# EAGLE design soil_sensor (EAGLE 9.6.2)
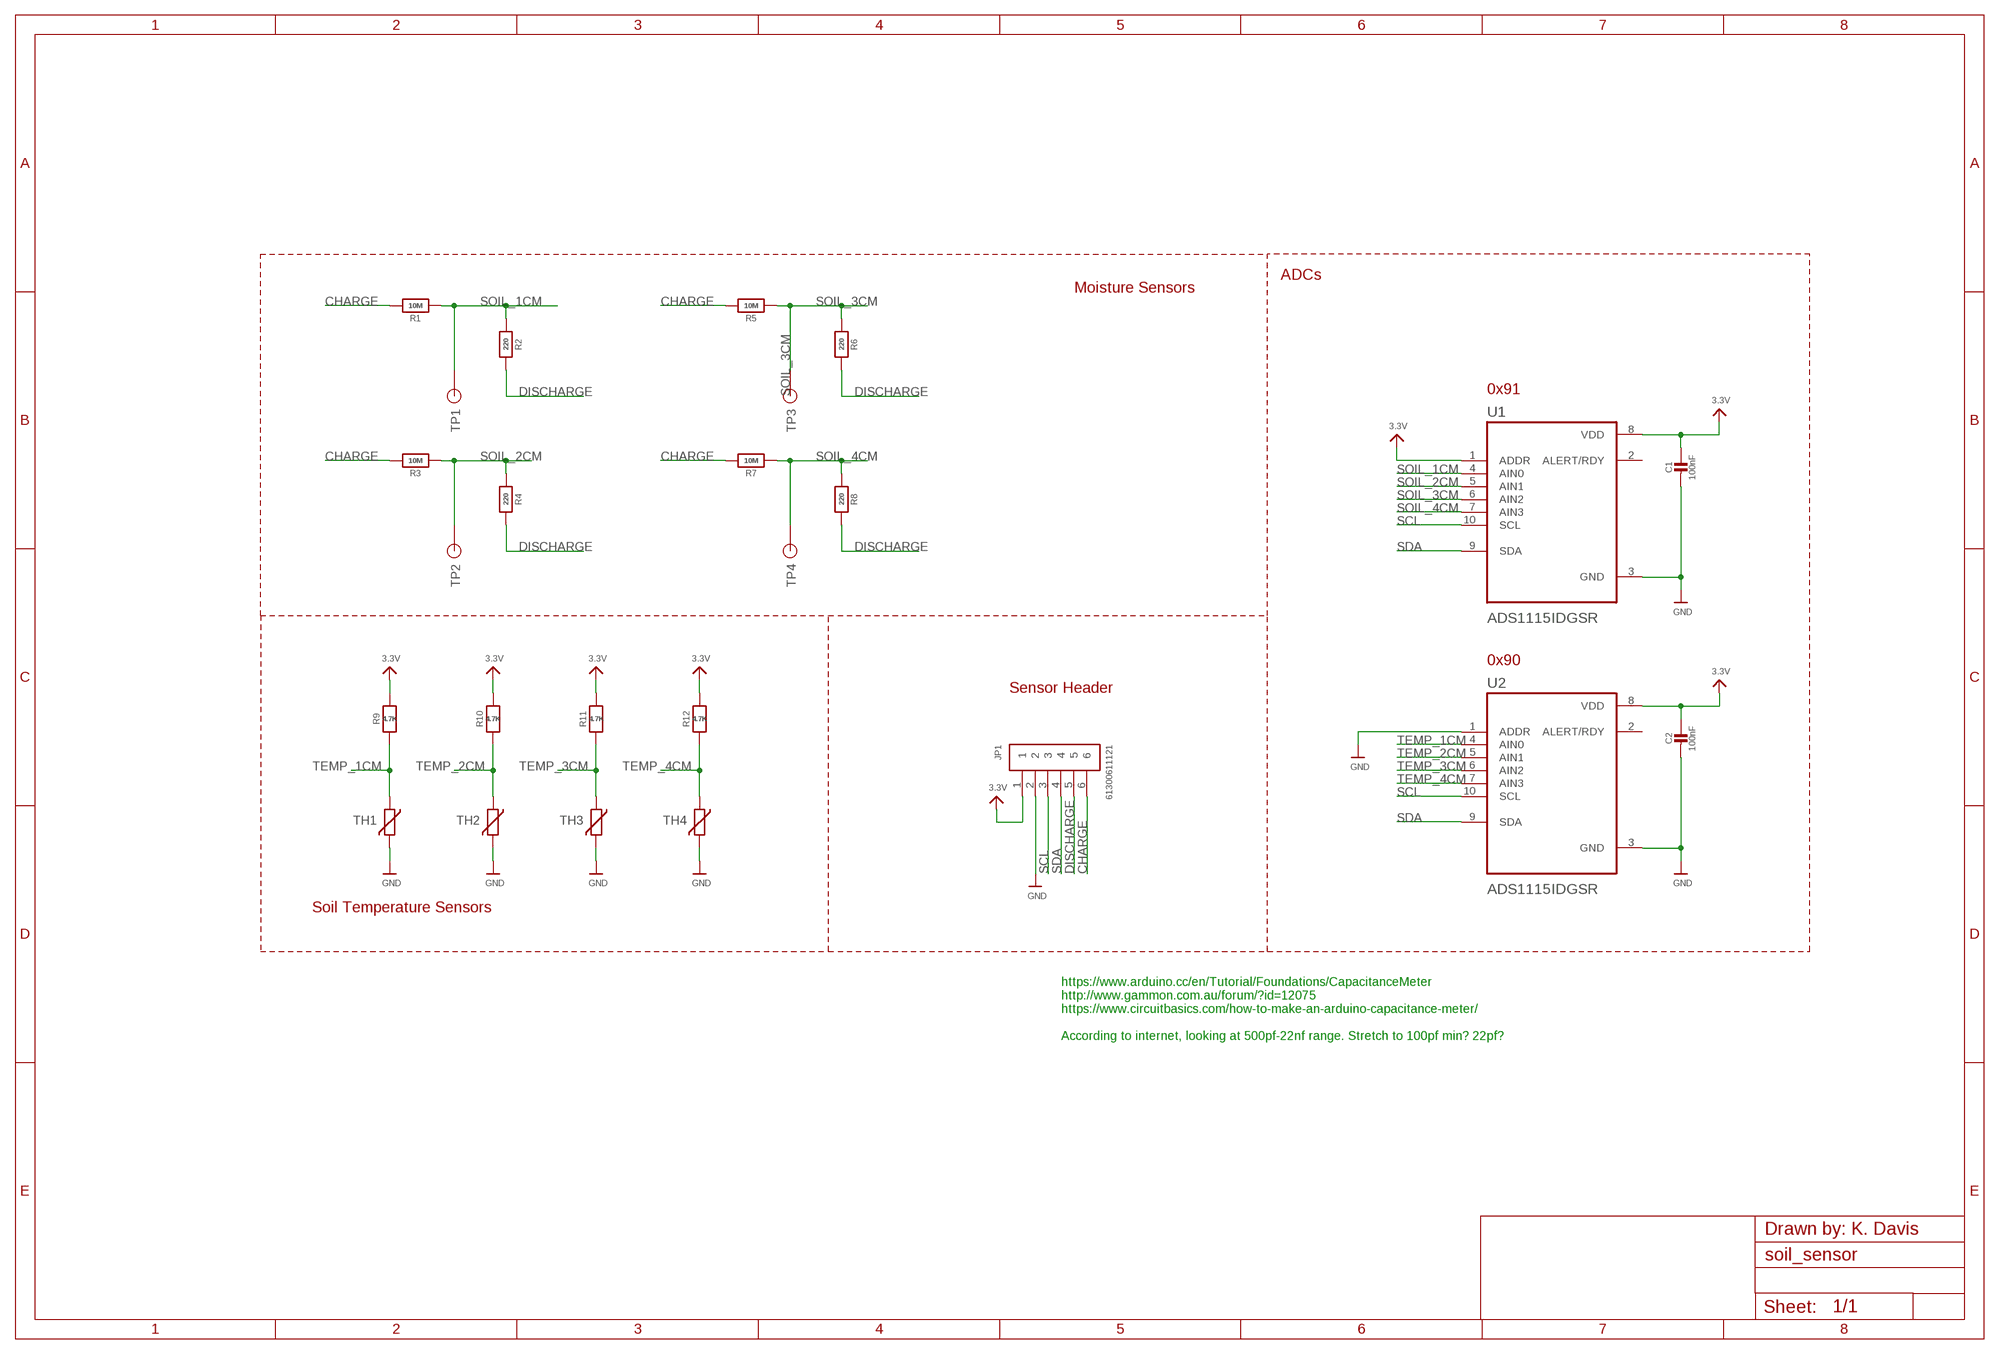
[diagram p0: schematic, sheet 1]

## Parts
C1  100nF  CAP_CERAMIC0805-NOOUTLINE  [0805-NO]
C2  100nF  CAP_CERAMIC0805-NOOUTLINE  [0805-NO]
JP1  61300611121  [61300611121]
R1  10M  RESISTOR0805_NOOUTLINE  [0805-NO]
R2  220  RESISTOR0805_NOOUTLINE  [0805-NO]
R3  10M  RESISTOR0805_NOOUTLINE  [0805-NO]
R4  220  RESISTOR0805_NOOUTLINE  [0805-NO]
R5  10M  RESISTOR0805_NOOUTLINE  [0805-NO]
R6  220  RESISTOR0805_NOOUTLINE  [0805-NO]
R7  10M  RESISTOR0805_NOOUTLINE  [0805-NO]
R8  220  RESISTOR0805_NOOUTLINE  [0805-NO]
R9  4.7K  RESISTOR0805_NOOUTLINE  [0805-NO]
R10  4.7K  RESISTOR0805_NOOUTLINE  [0805-NO]
R11  4.7K  RESISTOR0805_NOOUTLINE  [0805-NO]
R12  4.7K  RESISTOR0805_NOOUTLINE  [0805-NO]
TH1  VARISTORCN0805  [CT/CN0805]
TH2  VARISTORCN0805  [CT/CN0805]
TH3  VARISTORCN0805  [CT/CN0805]
TH4  VARISTORCN0805  [CT/CN0805]
TP1  TP  [TP_50MIL_CIRC]
TP2  TP  [TP_50MIL_CIRC]
TP3  TP  [TP_50MIL_CIRC]
TP4  TP  [TP_50MIL_CIRC]
U1  ADS1115IDGSR  [SOP50P490X110-10N]
U2  ADS1115IDGSR  [SOP50P490X110-10N]

## Nets
3.3V: C1.1 C2.1 JP1.1 R9.2 R10.2 R11.2 R12.2 U1.1(ADDR) U1.8(VDD) U2.8(VDD)
CHARGE: JP1.6 R1.2 R3.2 R5.2 R7.2
DISCHARGE: JP1.5 R2.2 R4.2 R6.2 R8.2
GND: C1.2 C2.2 JP1.2 TH1.2 TH2.2 TH3.2 TH4.2 U1.3(GND) U2.1(ADDR) U2.3(GND)
SCL: JP1.3 U1.10(SCL) U2.10(SCL)
SDA: JP1.4 U1.9(SDA) U2.9(SDA)
SOIL_1CM: R1.1 R2.1 TP1.1(TP) U1.4(AIN0)
SOIL_2CM: R3.1 R4.1 TP2.1(TP) U1.5(AIN1)
SOIL_3CM: R5.1 R6.1 TP3.1(TP) U1.6(AIN2)
SOIL_4CM: R7.1 R8.1 TP4.1(TP) U1.7(AIN3)
TEMP_1CM: R9.1 TH1.1 U2.4(AIN0)
TEMP_2CM: R10.1 TH2.1 U2.5(AIN1)
TEMP_3CM: R11.1 TH3.1 U2.6(AIN2)
TEMP_4CM: R12.1 TH4.1 U2.7(AIN3)
Unconnected: U1.2(ALERT/RDY) U2.2(ALERT/RDY)

## Notes on the sheet
- ADCs
- Moisture Sensors
- 0x91
- 0x90
- Sensor Header
- Soil Temperature Sensors
- https://www.arduino.cc/en/Tutorial/Foundations/CapacitanceMeter
  http://www.gammon.com.au/forum/?id=12075
  https://www.circuitbasics.com/how-to-make-an-arduino-capacitance-meter/
  
  According to internet, looking at 500pf-22nf range. Stretch to 100pf min? 22pf?
- Drawn by: K. Davis

## Library data of the parts
C1 C2 = microbuilder:CAP_CERAMIC: Ceramic Capacitors For new designs, use the packages preceded by an '_' character since they are more reliable: The following footprints should be used on most boards: _0402 - Standard footprint for regular board layouts _0603 - Standard footprint for regular board layouts _0805 - Standard footprint for regular board layouts _1206 - Standard footprint for regular board layouts For extremely tight-pitch boards where space is at a premium, the following 'micro-pitch' footprints can be used (smaller pads, no silkscreen outline, etc.): _0402MP - Micro-pitch footprint for very dense/compact boards _0603MP - Micro-pitch footprint for very dense/compact boards _0805MP - Micro-pitch footprint for very dense/compact boards _1206MP - Micro-pitch footprint for very dense/compact boards
JP1 = EarthPodLib:61300611121: CONN HEADER VERT 5POS 2.54MM Manufacturer's datasheet <https://katalog.we-online.de/em/datasheet/6130xx11121.pdf>; CREATED_BY: PCBLayout.com; DIGI_KEY_PART_NUMBER: 732-5318-ND; MANUFACTURER: Wurth Electronics Inc.; MPN: 61300511121
R1-R12 = microbuilder:RESISTOR: Resistors For new designs, use the packages preceded by an '_' character since they are more reliable: The following footprints should be used on most boards: _0402 - Standard footprint for regular board layouts _0603 - Standard footprint for regular board layouts _0805 - Standard footprint for regular board layouts _1206 - Standard footprint for regular board layouts For extremely tight-pitch boards where space is at a premium, the following 'micro-pitch' footprints can be used (smaller pads, no silkscreen outline, etc.): _0402MP - Micro-pitch footprint for very dense/compact boards _0603MP - Micro-pitch footprint for very dense/compact boards _0805MP - Micro-pitch footprint for very dense/compact boards _1206MP - Micro-pitch footprint for very dense/compact boards
TH1-TH4 = varistor:VARISTOR: VARISTOR
TP1-TP4 = EarthPodLib:TP
U1 U2 = EarthPodLib:ADS1115IDGSR: Check availability <https://pricing.snapeda.com/parts/ADS1115IDGSR/Texas%20Instruments/view-part?ref=eda>; AVAILABILITY: In Stock; DESCRIPTION: 16-Bit 860SPS 4-Ch Delta-Sigma ADC With PGA, Oscillator, Vref, Comparator, and I2C 10-VSSOP -40 to 125; MF: Texas Instruments; MP: ADS1115IDGSR; PACKAGE: VSSOP-10 Texas Instruments; PRICE: None; PURCHASE-URL: https://pricing.snapeda.com/search/part/ADS1115IDGSR/?ref=eda

## Net classes
1 highpower: width 0.305 mm, drill 0.483 mm
2 lowpower: width 0.254 mm, drill 0.483 mm

## Board
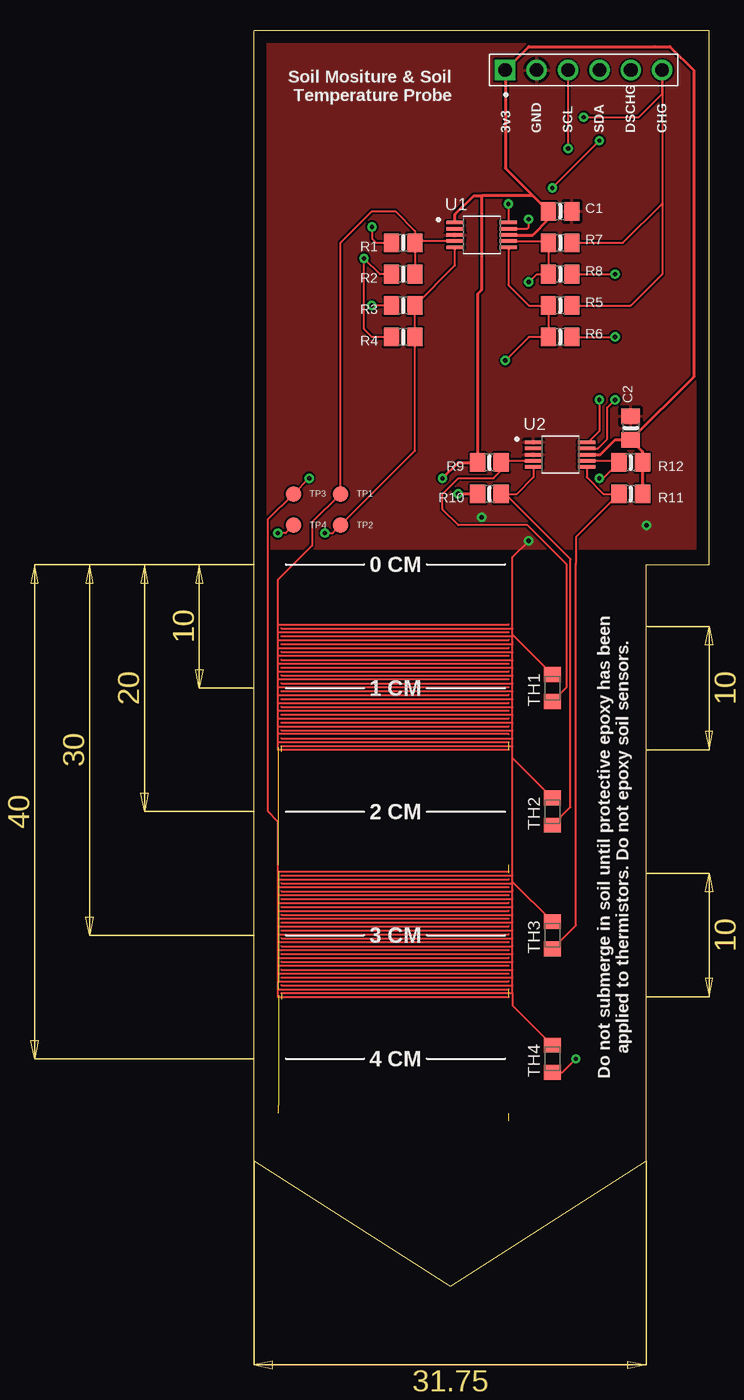
[diagram p1: board, top side]
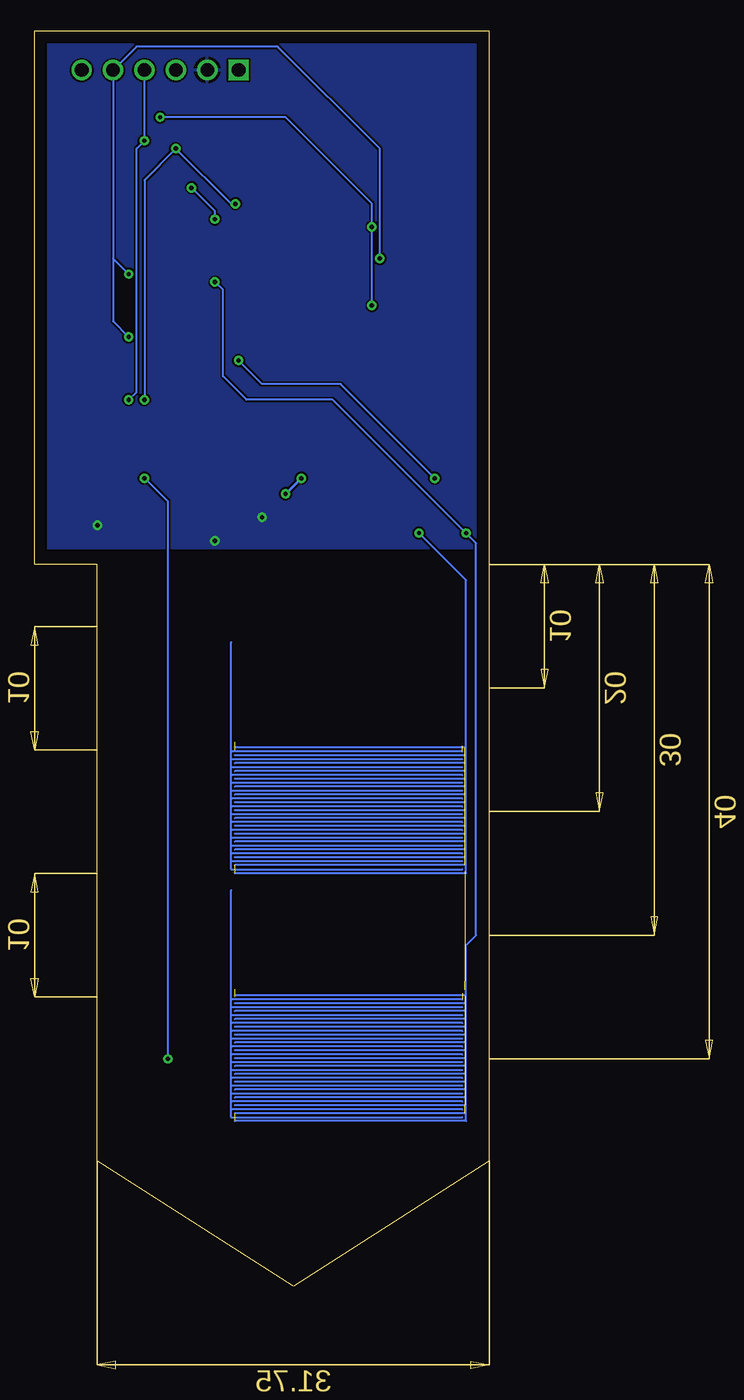
[diagram p2: board, bottom side, seen from below]

Size 36.83 x 101.6 mm. Coordinates in mm from the lower left corner, seen from the top.
Outline: 36.83,58.42 36.83,101.6 0,101.6 0,10.16 15.88,0 31.75,10.16 31.75,58.42 36.83,58.42
Copper layers (1*16): Top 0.035mm / dielectric 1.5mm / Bottom 0.035mm
Design rules "default *": minimum track width 6mil, minimum drill 0.35mm, track to track 6mil, track to pad 6mil, pad to pad 6mil, via to via 6mil, smd to smd 6mil, copper to edge 40mil, drill to drill 6mil, minimum pad ring 10mil, minimum via ring 8mil, stop-mask expansion 4mil, vias tented up to drill 0mil, thermal gap 10mil

### Footprints (pad centres in the part's own frame; a part is rotated, then mirrored left to right if it is on the bottom)
0805-NO = smd 1.24 x 1.5: 1 -0.95,0; 2 0.95,0
61300611121 = drill 1.1 square: 1 -6.35,0 | drill 1.1: 2 -3.81,0; 3 -1.27,0; 4 1.27,0; 5 3.81,0; 6 6.35,0
CT/CN0805 = smd 1.2 x 1.4: 1 -1.1,0; 2 1.1,0
TP_50MIL_CIRC = smd 1.27 x 1.27: 1 0,0
SOP50P490X110-10N = smd 1.47 x 0.28: 1 -2.15,1; 2 -2.15,0.5; 3 -2.15,0; 4 -2.15,-0.5; 5 -2.15,-1; 6 2.15,-1; 7 2.15,-0.5; 8 2.15,0; 9 2.15,0.5; 10 2.15,1

### Placement (x,y rotation side)
C1  24.77,87 0 top
C2  30.48,69.47 90 top
JP1  26.67,98.43 0 top
R1  12.06,84.45 180 top
R2  12.06,81.92 180 top
R3  12.06,79.38 180 top
R4  12.06,76.84 180 top
R5  24.77,79.38 0 top
R6  24.77,76.84 0 top
R7  24.77,84.45 0 top
R8  24.77,81.92 0 top
R9  19.05,66.67 180 top
R10  19.05,64.14 180 top
R11  30.48,64.14 0 top
R12  30.48,66.67 0 top
TH1  24.13,48.42 90 top
TH2  24.13,38.42 90 top
TH3  24.13,28.42 90 top
TH4  24.13,18.42 90 top
TP1  6.99,64.14 0 top
TP2  6.99,61.59 0 top
TP3  3.17,64.14 0 top
TP4  3.17,61.59 0 top
U1  18.41,85.09 0 top
U2  24.77,67.31 0 top

### Tracks (layer width: path | path; a pad name or v marks a point on that pad's centre or on a via)
3.3V  (via drill 0.35)
  Top 0.254: C1.1 20.32,90.49 JP1.1 22.23,100.33 32.38,100.33 33.66,100.33 35.56,98.43 35.56,73.6 C2.1 | C1.1 23.82,86.36 22.55,85.09 U1.8 | U2.8 28,67.31 29.21,68.52 C2.1 | U1.1 16.27,86.75 17.78,88.27 18.41,88.27 | C1.1 22.55,88.27 18.41,88.27 | C2.1 31.43,67.57 R12.2 R11.2 | 18.41,88.27 18.41,80.65 18.1,80.33 R9.2 16.51,66.67 v15.24,65.41 | R10.2 v16.51,64.14
  Bottom 0.254: v16.51,64.14 v15.24,65.41
CHARGE  (via drill 0.35)
  Top 0.152: 33.02,87.63 JP1.6 33.02,96.52 31.11,94.62 v26.67,94.62 | 33.02,87.63 29.84,84.45 R7.2 | 33.02,87.63 33.02,81.92 30.48,79.38 R5.2 | R3.2 v9.53,79.38 | v9.53,85.73 9.53,84.77 9.85,84.45 R1.2
  Bottom 0.152: v9.53,79.38 v9.53,85.72 v9.53,85.73 9.53,87.64 16.51,94.62 v26.67,94.62
DISCHARGE  (via drill 0.35)
  Top 0.152: R8.2 v29.21,81.92 | R6.2 v29.21,76.84 | R4.2 9.53,76.84 8.89,77.47 v8.89,83.19 10.16,81.92 R2.2
  Bottom 0.152: 30.48,83.19 JP1.5 28.57,100.33 17.14,100.33 8.89,92.08 v8.89,83.19 | 30.48,83.19 30.48,78.11 v29.21,76.84 | v29.21,81.92 30.48,83.19
GND  (via drill 0.35)  (2 unrouted)
  Top 0.152: v22.23,60.33 20.91,59.01 20.91,53.21 | 20.91,23.73 20.91,22.75 TH4.2 | 20.91,23.73 20.91,24.38 | 20.91,24.38 20.91,25.02 | 20.91,25.02 20.91,25.65 | 20.91,25.65 20.91,26.29 | 20.91,26.29 20.91,26.92 | 20.91,26.92 20.91,27.56 | 20.91,27.56 20.91,28.19 | 20.91,28.19 20.91,28.83 | 20.91,28.83 20.91,29.46 | 20.91,29.46 20.91,30.1 | 20.91,30.1 20.91,30.73 | 20.91,30.73 20.91,31.37 | 20.91,31.37 20.91,32 | 20.91,32 20.91,32.11 20.91,32.64 | 20.91,32.64 20.91,32.75 TH3.2 | 20.91,32.64 20.91,33.27 | 20.91,33.27 20.91,42.75 | 20.91,42.75 20.91,43.69 | 20.91,43.69 20.91,44.32 | 20.91,44.32 20.91,44.96 | 20.91,44.96 20.91,45.59 | 20.91,45.59 20.91,46.23 | 20.91,46.23 20.91,46.86 | 20.91,46.86 20.91,47.5 | 20.91,47.5 20.91,48.13 | 20.91,48.13 20.91,48.77 | 20.91,48.77 20.91,49.4 | 20.91,49.4 20.91,50.04 | 20.91,50.04 20.91,50.67 | 20.91,50.67 20.91,51.31 | 20.91,51.31 20.91,51.94 | 20.91,51.94 20.91,52.11 20.91,52.58 | 20.91,52.58 20.91,52.75 TH1.2 | 20.91,52.58 20.91,53.21 | 20.91,23.73 2.21,23.73 | 20.91,24.38 20.88,24.36 2.21,24.36 | 20.91,25.02 20.88,25 2.21,25 | 20.91,25.65 20.88,25.63 2.21,25.63 | 20.91,26.29 20.88,26.27 2.21,26.27 | 20.91,26.92 20.88,26.9 2.21,26.9 | 20.91,27.56 20.88,27.54 2.21,27.54 | 20.91,28.19 20.88,28.17 2.21,28.17 | 20.91,28.83 20.88,28.81 2.21,28.81 | 20.91,29.46 20.88,29.44 2.21,29.44 | 20.91,30.1 20.88,30.08 2.21,30.08 | 20.91,30.73 20.88,30.71 2.21,30.71 | 20.91,31.37 20.88,31.35 2.21,31.35 | 20.91,32 20.88,31.98 2.21,31.98 | 20.91,32.64 20.88,32.62 2.21,32.62 | 20.91,33.27 20.88,33.25 2.21,33.25 | TH2.2 20.91,42.75 | 20.91,43.69 20.87,43.73 2.21,43.73 | 20.91,44.32 20.87,44.36 2.21,44.36 | 20.91,44.96 20.87,45 2.21,45
  Top 0.152: 20.91,45.59 20.87,45.63 2.21,45.63 | 20.91,46.23 20.87,46.27 2.21,46.27 | 20.91,46.86 20.87,46.9 2.21,46.9 | 20.91,47.5 20.87,47.54 2.21,47.54 | 20.91,48.13 20.87,48.17 2.21,48.17 | 20.91,48.77 20.87,48.8 2.21,48.8 | 20.91,49.4 20.87,49.44 2.21,49.44 | 20.91,50.04 20.87,50.08 2.21,50.08 | 20.91,50.67 20.87,50.71 2.21,50.71 | 20.91,51.31 20.87,51.34 2.21,51.34 | 20.91,51.94 20.87,51.98 2.21,51.98 | 20.91,52.58 20.87,52.62 2.21,52.62 | 20.91,53.21 20.87,53.25 2.21,53.25
  Bottom 0.152: 20.91,14.35 20.91,13.69 2.21,13.69 | 20.91,14.35 20.91,14.99 | 20.91,14.99 20.91,15.62 | 20.91,15.62 20.91,16.26 | 20.91,16.26 20.91,16.89 | 20.91,16.89 20.91,17.53 | 20.91,17.53 20.91,18.16 | 20.91,18.16 20.91,18.8 | 20.91,18.8 20.91,19.43 | 20.91,19.43 20.91,20.07 | 20.91,20.07 20.91,20.7 | 20.91,20.7 20.91,21.34 | 20.91,21.34 20.91,21.97 | 20.91,22.61 20.91,23.24 | 20.91,23.24 20.91,32.08 | 20.91,14.35 20.88,14.33 2.21,14.33 | 20.91,14.99 20.88,14.96 2.21,14.96 | 20.91,15.62 20.88,15.6 2.21,15.6 | 20.91,16.26 20.88,16.23 2.21,16.23 | 20.91,16.89 20.88,16.87 2.21,16.87 | 20.91,17.53 20.88,17.5 2.21,17.5 | 20.91,18.16 20.88,18.14 2.21,18.14 | 20.91,18.8 20.88,18.77 2.21,18.77 | 20.91,19.43 20.88,19.41 2.21,19.41 | 20.91,20.07 20.88,20.04 2.21,20.04 | 20.91,20.7 20.88,20.68 2.21,20.68 | 20.91,21.34 20.88,21.31 2.21,21.31 | 20.91,21.97 20.88,21.95 2.21,21.95 | 20.91,22.61 20.88,22.58 2.21,22.58 | 20.91,23.24 20.88,23.22 2.21,23.22 | 20.91,21.97 20.91,22.61 | 20.91,34.42 20.91,33.76 2.21,33.76 | 20.91,34.42 20.91,35.05 | 20.91,35.05 20.91,35.69 | 20.91,35.69 20.91,36.32 | 20.91,36.32 20.91,36.96 | 20.91,36.96 20.91,37.59 | 20.91,37.59 20.91,38.23 | 20.91,38.23 20.91,38.86 | 20.91,38.86 20.91,39.5 | 20.91,39.5 20.91,40.13 | 20.91,40.13 20.91,40.77 | 20.91,40.77 20.91,41.4 | 20.91,41.4 20.91,42.04 | 20.91,42.67 20.91,43.31 | 20.91,43.31 20.91,52.14 | 20.91,34.42 20.88,34.39 2.21,34.39 | 20.91,35.05 20.88,35.03 2.21,35.03 | 20.91,35.69 20.88,35.66 2.21,35.66 | 20.91,36.32 20.88,36.3 2.21,36.3 | 20.91,36.96 20.88,36.93 2.21,36.93 | 20.91,37.59 20.88,37.57 2.21,37.57 | 20.91,38.23 20.88,38.2 2.21,38.2 | 20.91,38.86 20.88,38.84 2.21,38.84 | 20.91,39.5 20.88,39.47 2.21,39.47
  Bottom 0.152: 20.91,40.13 20.88,40.11 2.21,40.11 | 20.91,40.77 20.88,40.74 2.21,40.74 | 20.91,41.4 20.88,41.38 2.21,41.38 | 20.91,42.04 20.88,42.01 2.21,42.01 | 20.91,42.67 20.88,42.65 2.21,42.65 | 20.91,43.31 20.88,43.28 2.21,43.28 | 20.91,42.04 20.91,42.67
  other vias: 18.41,62.23 31.75,61.59
  pour Top: -4.45,59.69 41.91,59.69 41.91,105.41 -4.45,105.41
  pour Bottom: -5.71,59.69 43.18,59.69 43.18,106.68 -5.71,106.68
SCL  (via drill 0.35)
  Top 0.152: U2.10 27.04,68.31 27.94,69.22 v27.94,71.75 | v20.57,87.61 20.57,86.1 U1.10 | JP1.3 v25.4,92.08 JP1.3
  Bottom 0.152: v27.94,71.75 27.94,89.53 v25.4,92.08 20.93,87.61 v20.57,87.61
SDA  (via drill 0.35)
  Top 0.152: U2.9 27.8,67.81 28.57,68.58 28.57,71.12 v29.21,71.75 | U1.9 22.09,85.59 22.23,85.72 v22.23,86.36 | v24.13,88.9 v27.94,92.71
  Bottom 0.152: v29.21,71.75 28.57,72.39 28.57,92.08 v27.94,92.71 JP1.4 | v22.23,86.36 22.23,87 v24.13,88.9
SOIL_1CM  (1 unrouted)
  Top 0.152: U1.4 13.15,84.59 R1.1 | R1.1 R2.1 | 1.91,53.58 1.91,57.15 4.7,59.94 4.7,61.85 TP1.1 6.99,84.45 9.53,87 11.43,87 13.02,85.41 R1.1 | 1.91,53.58 1.91,52.95 | 1.91,52.95 1.91,52.31 | 1.91,52.31 1.91,51.68 | 1.91,51.68 1.91,51.04 | 1.91,51.04 1.91,50.41 | 1.91,50.41 1.91,49.77 | 1.91,49.77 1.91,49.14 | 1.91,49.14 1.91,48.5 | 1.91,48.5 1.91,47.87 | 1.91,47.87 1.91,47.23 | 1.91,47.23 1.91,46.59 | 1.91,46.59 1.91,45.96 | 1.91,45.96 1.91,45.33 | 1.91,45.33 1.91,44.69 | 1.91,44.69 1.91,43.42 20.6,43.42 | 20.6,44.69 1.91,44.69 | 1.91,45.33 20.6,45.33 | 1.91,45.96 20.6,45.96 | 1.91,46.59 20.6,46.59 | 1.91,47.23 20.6,47.23 | 1.91,47.87 20.6,47.87 | 1.91,48.5 20.6,48.5 | 1.91,49.14 20.6,49.14 | 1.91,49.77 20.6,49.77 | 1.91,50.41 20.6,50.41 | 1.91,51.04 20.6,51.04 | 1.91,51.68 20.6,51.68 | 1.91,52.31 20.6,52.31 | 1.91,52.95 20.6,52.95 | 1.91,53.58 20.6,53.58 | 20.6,44.05 | 1.91,44.05 20.6,44.05
SOIL_2CM  (via drill 0.35)  (16 unrouted)
  Top 0.152: v5.71,60.96 6.35,60.96 TP2.1 13.02,67.62 R4.1 R3.1 16.27,82.62 U1.5
  Bottom 0.152: 1.98,43.61 20.6,43.61 | 20.6,33.45 1.91,33.45 1.91,57.15 v5.71,60.96 | 1.98,34.72 20.6,34.72 | 1.98,34.09 20.6,34.09 | 1.98,35.36 20.6,35.36 | 1.98,35.99 20.6,35.99 | 1.98,36.63 20.6,36.63 | 1.98,37.26 20.6,37.26 | 1.98,37.9 20.6,37.9 | 1.98,38.53 20.6,38.53 | 1.98,39.17 20.6,39.17 | 1.98,39.8 20.6,39.8 | 1.98,40.44 20.6,40.44 | 1.98,41.07 20.6,41.07 | 1.98,41.71 20.6,41.71 | 1.98,42.34 20.6,42.34 | 1.98,42.98 20.6,42.98
SOIL_3CM  (via drill 0.35)  (16 unrouted)
  Top 0.152: U1.6 20.57,81.03 22.23,79.38 R5.1 R6.1 22.23,76.84 v20.32,74.93 | 1.98,33.58 20.6,33.58 | 20.6,23.42 1.91,23.42 1.91,37.64 1.09,38.46 1.09,62.05 TP3.1 v4.45,65.41 | 1.98,24.69 20.6,24.69 | 1.98,24.05 20.6,24.05 | 1.98,25.33 20.6,25.33 | 1.98,25.96 20.6,25.96 | 1.98,26.6 20.6,26.6 | 1.98,27.23 20.6,27.23 | 1.98,27.87 20.6,27.87 | 1.98,28.5 20.6,28.5 | 1.98,29.14 20.6,29.14 | 1.98,29.77 20.6,29.77 | 1.98,30.41 20.6,30.41 | 1.98,31.04 20.6,31.04 | 1.98,31.68 20.6,31.68 | 1.98,32.31 20.6,32.31 | 1.98,32.95 20.6,32.95
  Bottom 0.152: v4.45,65.41 12.06,73.03 18.41,73.03 v20.32,74.93
SOIL_4CM  (via drill 0.35)  (16 unrouted)
  Top 0.152: U1.7 23.68,84.59 R7.1 R8.1 22.86,81.92 v22.23,81.28 | TP4.1 2.54,60.96 v1.91,60.96
  Bottom 0.152: 1.98,23.55 20.6,23.55 | 20.6,13.39 1.91,13.39 1.91,27.61 1.09,28.42 1.09,60.15 v1.91,60.96 12.7,71.75 19.68,71.75 21.59,73.66 21.59,80.65 v22.23,81.28 | 1.98,14.66 20.6,14.66 | 1.98,14.02 20.6,14.02 | 1.98,15.29 20.6,15.29 | 1.98,15.93 20.6,15.93 | 1.98,16.56 20.6,16.56 | 1.98,17.2 20.6,17.2 | 1.98,17.83 20.6,17.83 | 1.98,18.47 20.6,18.47 | 1.98,19.1 20.6,19.1 | 1.98,19.74 20.6,19.74 | 1.98,20.37 20.6,20.37 | 1.98,21.01 20.6,21.01 | 1.98,21.64 20.6,21.64 | 1.98,22.28 20.6,22.28 | 1.98,22.91 20.6,22.91
TEMP_1CM
  Top 0.152: U2.4 20.14,66.81 R9.1 20,66.04 19.36,65.41 16.51,65.41 15.24,64.14 15.24,62.87 16.51,61.59 22.12,61.59 25.3,58.42 25.3,48.49 TH1.1
TEMP_2CM
  Top 0.152: 20.32,64.14 R10.1 20,63.5 | 20.32,64.14 21.27,64.14 22.61,65.48 U2.5 | TH2.1 25.6,38.79 25.6,58.85 20.32,64.14
TEMP_3CM
  Top 0.152: U2.6 26.91,65.48 28.26,64.14 R11.1 26.04,60.64 26.04,58.55 26.04,58.42 26.04,29.23 TH3.1
TEMP_4CM  (via drill 0.35)
  Top 0.152: U2.7 29.39,66.81 R12.1 28.26,65.41 v27.94,65.41 | TH4.1 24.94,17.32 v26.04,18.41
  Bottom 0.152: v27.94,65.41 26.04,63.5 v26.04,18.41

### Text on the board
tNames: Soil Mositure & Soil / Temperature Probe | 3v3 | GND | SCL | SDA | DSCHG | CHG | 0 CM | 1 CM | 2 CM | Do not submerge in soil until protective epoxy has been / applied to thermistors. Do not epoxy soil sensors. | 3 CM | 4 CM